# EAGLE design DMXextension (EAGLE 6.2)
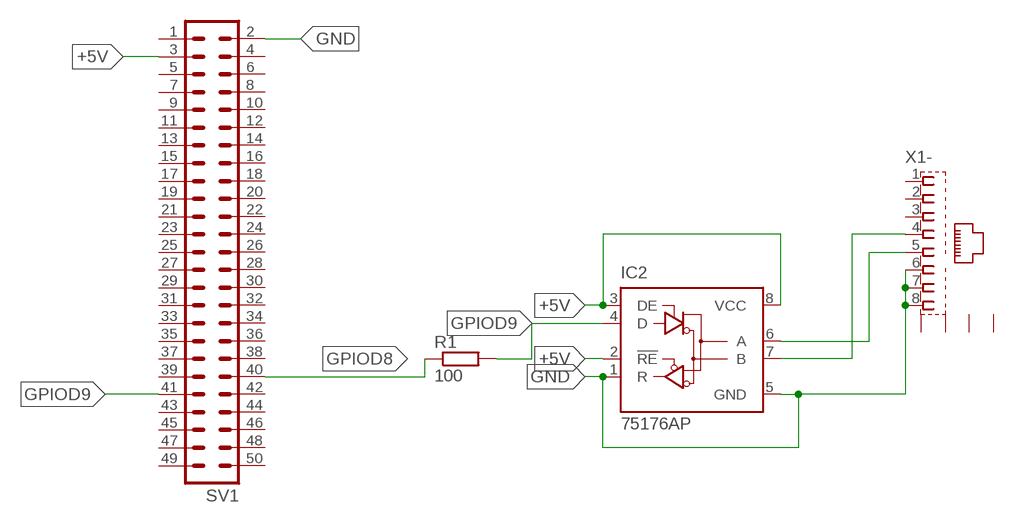
[diagram p0: schematic, sheet 1]

## Parts
IC2  75176AP  [DIL08]
R1  100  R-EU_R0805  [R0805]
SV1  ML50  [ML50]
X1  RJ45  [RJ45]

## Nets
+5V: IC2.2(!RE) IC2.3(DE) IC2.8(VCC) SV1.3
GND: IC2.1(R) IC2.5(GND) SV1.2 X1.6 X1.7 X1.8
GPIOD8: R1.1 SV1.40
GPIOD9: IC2.4(D) R1.2 SV1.41
N$1: IC2.7(B) X1.4
N$2: IC2.6(A) X1.5
Unconnected: SV1.1 SV1.4 SV1.5 SV1.6 SV1.7 SV1.8 SV1.9 SV1.10 SV1.11 SV1.12 SV1.13 SV1.14 SV1.15 SV1.16 SV1.17 SV1.18 SV1.19 SV1.20 SV1.21 SV1.22 SV1.23 SV1.24 SV1.25 SV1.26 SV1.27 SV1.28 SV1.29 SV1.30 SV1.31 SV1.32 SV1.33 SV1.34 SV1.35 SV1.36 SV1.37 SV1.38 SV1.39 SV1.42 SV1.43 SV1.44 SV1.45 SV1.46 SV1.47 SV1.48 SV1.49 SV1.50 X1.1 X1.2 X1.3 X1.G1 X1.G2 X1.G3 X1.G4

## Library data of the parts
IC2 = 751xx:75176A: DIFFERENTIAL BUS TRANSCEIVER Source: http://focus.ti.com/lit/ds/symlink/sn75176a.pdf
R1 = rcl:R-EU_: RESISTOR, European symbol
SV1 = con-ml:ML50: HARTING; OC_FARNELL: unknown; OC_NEWARK: unknown
X1 = con-appsys:RJ45: AMP connector

## Board
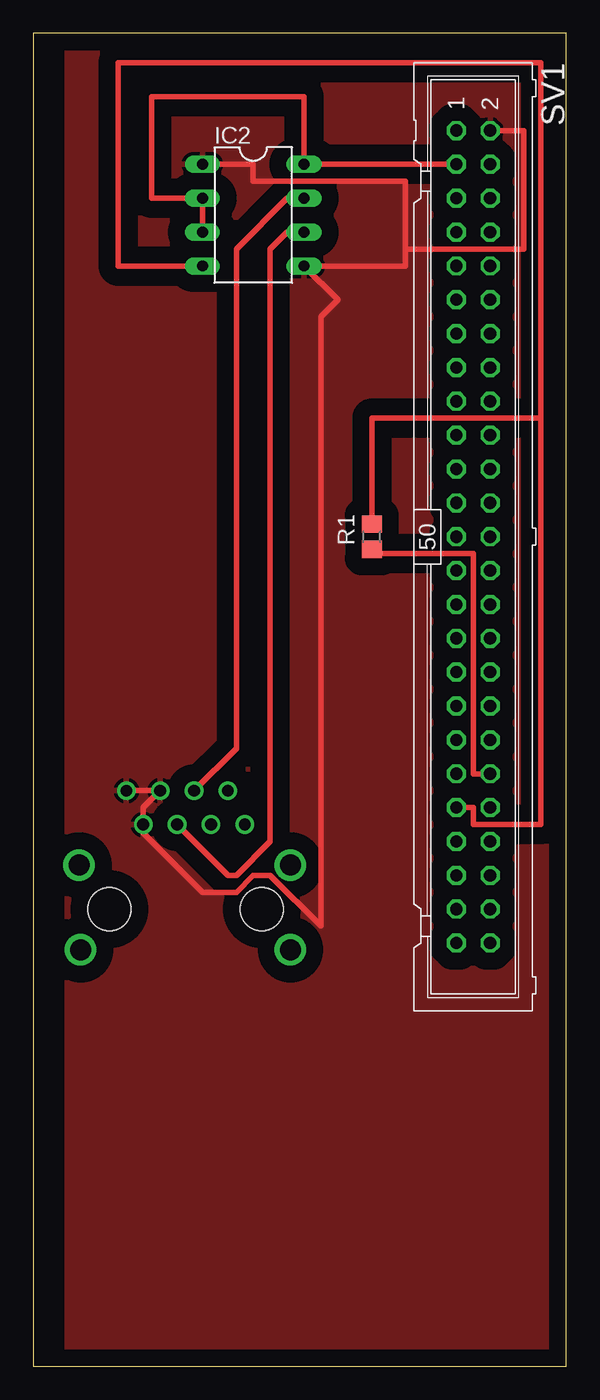
[diagram p1: board, top side]
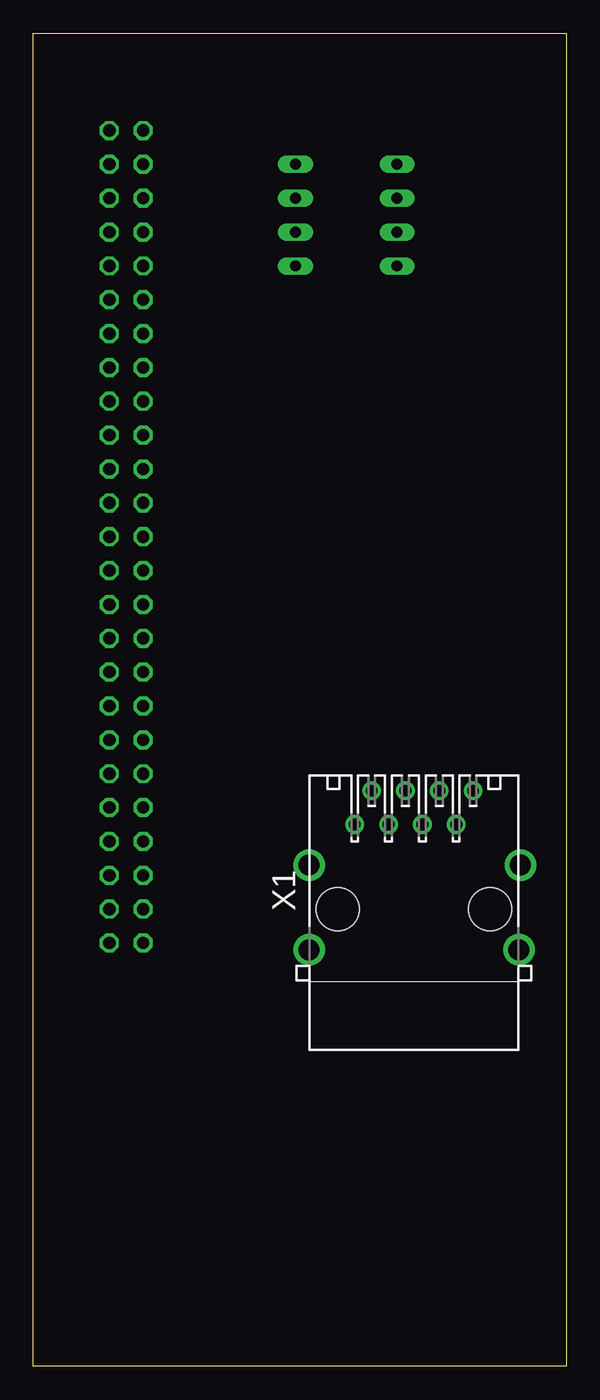
[diagram p2: board, bottom side, seen from below]

Size 40 x 100 mm. Coordinates in mm from the lower left corner, seen from the top.
Outline: 0,0 40,0 40,100 0,100 0,0
Copper layers (1*16): Top 0.035mm / dielectric 1.5mm / Bottom 0.035mm
Design rules: minimum track width 10mil, minimum drill 24mil, track to track 8mil, track to pad 8mil, pad to pad 8mil, via to via 8mil, smd to smd 8mil, copper to edge 40mil, drill to drill 8mil, minimum pad ring 10mil, minimum via ring 8mil, stop-mask expansion 4mil, vias tented up to drill 0mil, thermal gap 10mil

### Footprints (pad centres in the part's own frame; a part is rotated, then mirrored left to right if it is on the bottom)
DIL08 = drill 0.813 long: 1 -3.81,-3.81; 2 -1.27,-3.81; 3 1.27,-3.81; 4 3.81,-3.81; 5 3.81,3.81; 6 1.27,3.81; 7 -1.27,3.81; 8 -3.81,3.81
R0805 = smd 1.3 x 1.5: 1 -0.95,0; 2 0.95,0
ML50 = drill 0.914 octagon: 1 -30.48,-1.27; 2 -30.48,1.27; 3 -27.94,-1.27; 4 -27.94,1.27; 5 -25.4,-1.27; 6 -25.4,1.27; 7 -22.86,-1.27; 8 -22.86,1.27; 9 -20.32,-1.27; 10 -20.32,1.27; 11 -17.78,-1.27; 12 -17.78,1.27; 13 -15.24,-1.27; 14 -15.24,1.27; 15 -12.7,-1.27; 16 -12.7,1.27; 17 -10.16,-1.27; 18 -10.16,1.27; 19 -7.62,-1.27; 20 -7.62,1.27; 21 -5.08,-1.27; 22 -5.08,1.27; 23 -2.54,-1.27; 24 -2.54,1.27; 25 0,-1.27; 26 0,1.27; 27 2.54,-1.27; 28 2.54,1.27; 29 5.08,-1.27; 30 5.08,1.27; 31 7.62,-1.27; 32 7.62,1.27; 33 10.16,-1.27; 34 10.16,1.27; 35 12.7,-1.27; 36 12.7,1.27; 37 15.24,-1.27; 38 15.24,1.27; 39 17.78,-1.27; 40 17.78,1.27; 41 20.32,-1.27; 42 20.32,1.27; 43 22.86,-1.27; 44 22.86,1.27; 45 25.4,-1.27; 46 25.4,1.27; 47 27.94,-1.27; 48 27.94,1.27; 49 30.48,-1.27; 50 30.48,1.27
RJ45 = drill 0.889: 1 -4.445,6.35; 2 -3.175,8.89; 3 -1.905,6.35; 4 -0.635,8.89; 5 0.635,6.35; 6 1.905,8.89; 7 3.175,6.35; 8 4.445,8.89 | drill 1.575 pad 2.184: G1 -7.874,-3.048; G2 7.874,-3.048; G3 -7.874,3.302; G4 8.001,3.302 | hole 3.251: -5.715,0; 5.715,0

### Placement (x,y rotation side)
IC2  16.51,86.36 270 top
R1  25.4,62.23 90 top
SV1  33.02,62.23 270 top
X1  11.43,34.29 0 bottom

### Tracks (layer width: path | path; a pad name or v marks a point on that pad's centre or on a via)
+5V
  Top 0.406: SV1.3 IC2.8 20.32,95.25 8.89,95.25 8.89,87.63 IC2.2 IC2.3
GND
  Top 0.406: SV1.2 36.83,92.71 36.83,83.82 27.94,83.82 | 27.94,83.82 27.94,82.55 IC2.5 22.86,80.01 21.59,78.74 21.59,33.02 17.78,36.83 16.51,36.83 15.24,35.56 12.7,35.56 8.26,40.01 X1.7 8.26,41.91 X1.6 X1.8 | IC2.1 16.51,90.17 16.51,88.9 27.94,88.9 27.94,83.82
  pour Top (isolate 1.27): 2.54,99.06 39.37,99.06 39.37,1.27 2.54,1.27
GPIOD8
  Top 0.406: SV1.40 33.02,44.45 33.02,60.96 25.4,60.96 R1.1
GPIOD9
  Top 0.406: R1.2 25.4,71.12 38.1,71.12 | 38.1,71.12 38.1,97.79 6.35,97.79 6.35,82.55 IC2.4 | SV1.41 33.02,41.91 33.02,40.64 38.1,40.64 38.1,71.12
N$1
  Top 0.406: IC2.7 19.05,87.63 15.24,83.82 15.24,46.35 X1.4
N$2
  Top 0.406: IC2.6 19.05,85.09 17.78,83.82 17.78,39.37 15.24,36.83 14.61,36.83 X1.5